# EAGLE design wire_detector (EAGLE 6.2)
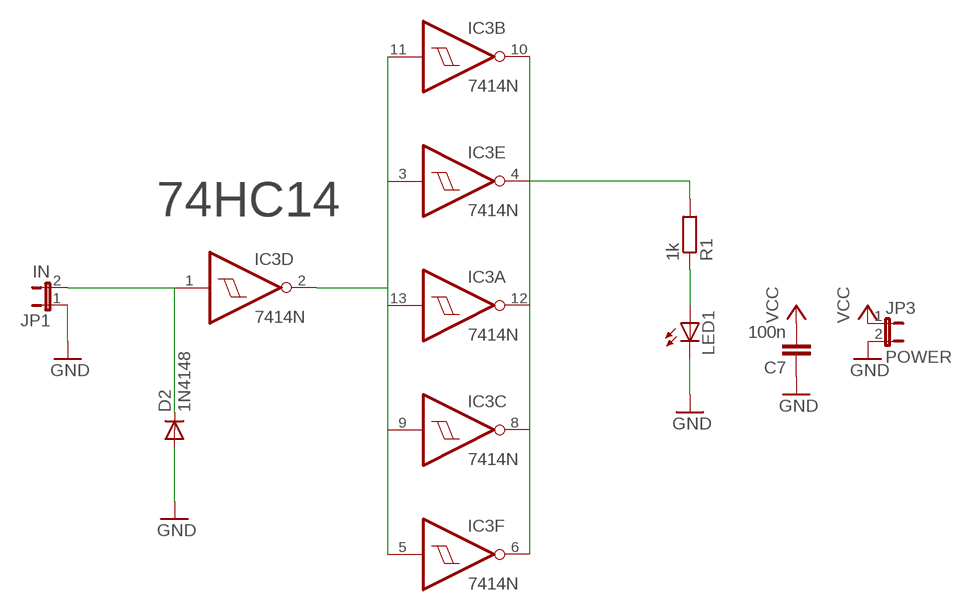
[diagram p0: schematic, sheet 1]

## Parts
C7  100n  C-EU025-024X044  [C025-024X044]
D2  1N4148  DIODE-D-2.5  [D-2.5]
IC3  7414N  [DIL14]
JP1  IN  JP1E  [JP1]
JP3  POWER  JP1E  [JP1]
LED1  LED5MM  [LED5MM]
R1  1k  R-EU_0204/5  [0204/5]

## Nets
GND: C7.1 D2.A JP1.1 JP3.2 LED1.K(C)
N$2: IC3.4(E:O) IC3.6(F:O) IC3.8(C:O) IC3.10(B:O) IC3.12(A:O) R1.2
N$3: LED1.A R1.1
N$5: IC3.2(D:O) IC3.3(E:I) IC3.5(F:I) IC3.9(C:I) IC3.11(B:I) IC3.13(A:I)
N$6: D2.C IC3.1(D:I) JP1.2
VCC: C7.2 JP3.1

## Notes on the sheet
- 74HC14

## Power pins joined to a net without a drawn wire
GND: IC3.7(P:GND)
VCC: IC3.14(P:VCC)

## Library data of the parts
C7 = rcl:C-EU: CAPACITOR, European symbol
D2 = diode:DIODE-: DIODE
IC3 = 74xx-eu:74*14: Hex schmitt trigger INVERTER
JP1 JP3 = jumper:JP1E: JUMPER
LED1 = led:LED: LED OSRAM: - CHIPLED LG R971, LG N971, LY N971, LG Q971, LY Q971, LO R971, LY R971 LH N974, LH R974 LS Q976, LO Q976, LY Q976 LO Q996 - Hyper CHIPLED LW Q18S LB Q993, LB Q99A, LB R99A - SideLED LS A670, LO A670, LY A670, LG A670, LP A670 LB A673, LV A673, LT A673, LW A673 LH A674 LY A675 LS A676, LA A676, LO A676, LY A676, LW A676 LS A679, LY A679, LG A679 - Hyper Micro SIDELED® LS Y876, LA Y876, LO Y876, LY Y876 LT Y87S - SmartLED LW L88C, LW L88S LB L89C, LB L89S, LG L890 LS L89K, LO L89K, LY L89K LS L896, LA L896, LO L896, LY L896 - TOPLED LS T670, LO T670, LY T670, LG T670, LP T670 LSG T670, LSP T670, LSY T670, LOP T670, LYG T670 LG T671, LOG T671, LSG T671 LB T673, LV T673, LT T673, LW T673 LH T674 LS T676, LA T676, LO T676, LY T676, LB T676, LH T676, LSB T676, LW T676 LB T67C, LV T67C, LT T67C, LS T67K, LO T67K, LY T67K, LW E67C LS E67B, LA E67B, LO E67B, LY E67B, LB E67C, LV E67C, LT E67C LW T67C LS T679, LY T679, LG T679 LS T770, LO T770, LY T770, LG T770, LP T770 LB T773, LV T773, LT T773, LW T773 LH T774 LS E675, LA E675, LY E675, LS T675 LS T776, LA T776, LO T776, LY T776, LB T776 LHGB T686 LT T68C, LB T68C - Hyper Mini TOPLED® LB M676 - Mini TOPLED Santana® LG M470 LS M47K, LO M47K, LY M47K Source: http://www.osram.convergy.de LUXEON: - LUMILED® LXK2-PW12-R00, LXK2-PW12-S00, LXK2-PW14-U00, LXK2-PW14-V00 LXK2-PM12-R00, LXK2-PM12-S00, LXK2-PM14-U00 LXK2-PE12-Q00, LXK2-PE12-R00, LXK2-PE12-S00, LXK2-PE14-T00, LXK2-PE14-U00 LXK2-PB12-K00, LXK2-PB12-L00, LXK2-PB12-M00, LXK2-PB14-N00, LXK2-PB14-P00, LXK2-PB14-Q00 LXK2-PR12-L00, LXK2-PR12-M00, LXK2-PR14-Q00, LXK2-PR14-R00 LXK2-PD12-Q00, LXK2-PD12-R00, LXK2-PD12-S00 LXK2-PH12-R00, LXK2-PH12-S00 LXK2-PL12-P00, LXK2-PL12-Q00, LXK2-PL12-R00 Source: www.luxeon.com KINGBRIGHT: KA-3528ASYC Source: www.kingbright.com
R1 = rcl:R-EU_: RESISTOR, European symbol

## Board
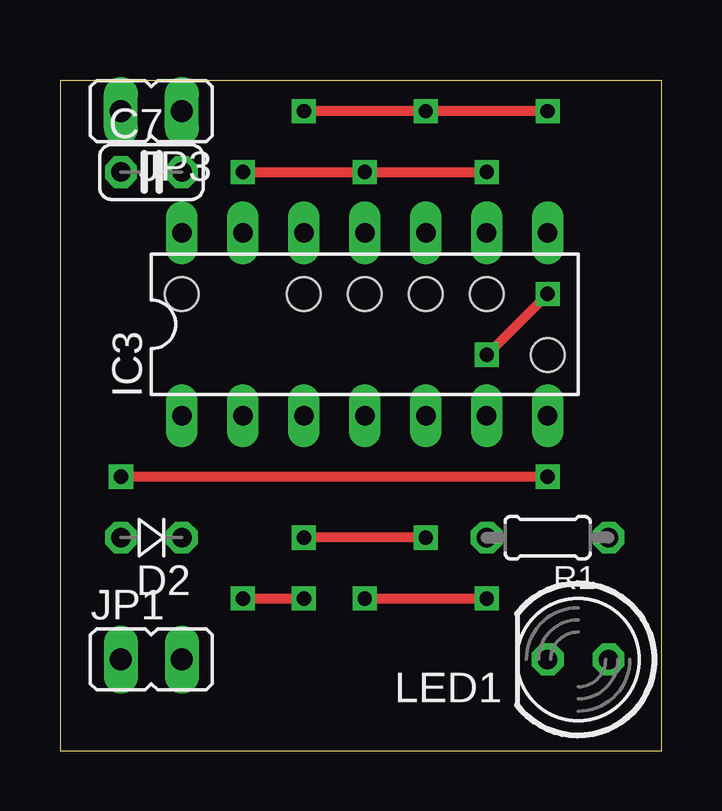
[diagram p1: board, top side]
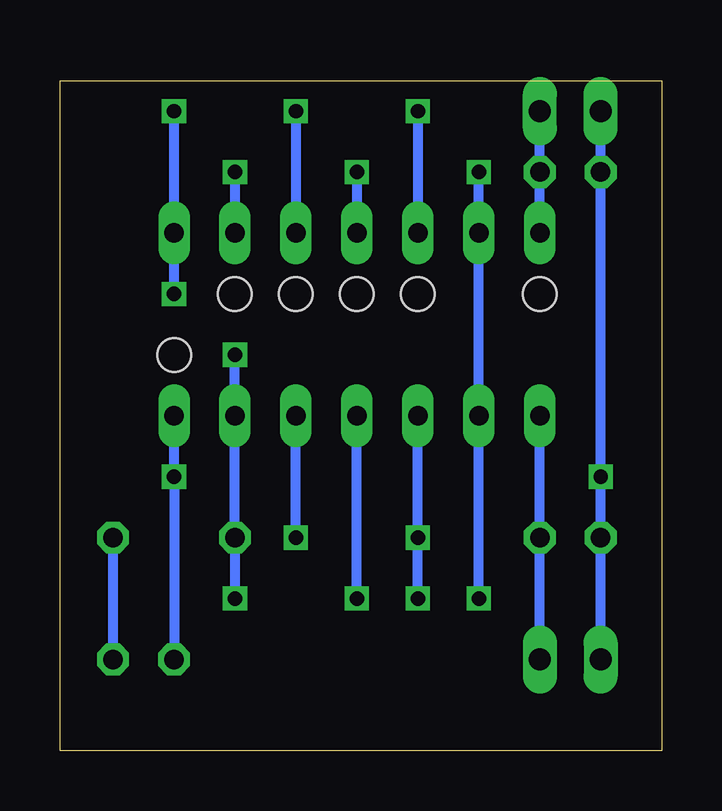
[diagram p2: board, bottom side, seen from below]

Size 25.07 x 27.93 mm. Coordinates in mm from the lower left corner, seen from the top.
Outline: 0,0 25.07,0 25.07,27.93 0,27.93 0,0
Copper layers (1*16): Top 0.035mm / dielectric 1.5mm / Bottom 0.035mm
Design rules: minimum track width 10mil, minimum drill 24mil, track to track 8mil, track to pad 8mil, pad to pad 8mil, via to via 8mil, smd to smd 8mil, copper to edge 40mil, drill to drill 8mil, minimum pad ring 10mil, minimum via ring 8mil, stop-mask expansion 4mil, vias tented up to drill 0mil, thermal gap 10mil
Holes 1.4 mm at 5.08,19.05 10.16,19.05 12.7,19.05 15.24,19.05 17.78,19.05 20.32,16.51

### Footprints (pad centres in the part's own frame; a part is rotated, then mirrored left to right if it is on the bottom)
C025-024X044 = drill 0.813 octagon: 1 -1.27,0; 2 1.27,0
D-2.5 = drill 0.813 octagon: A 1.27,0; C -1.27,0
DIL14 = drill 0.813 long: 1 -7.62,-3.81; 2 -5.08,-3.81; 3 -2.54,-3.81; 4 0,-3.81; 5 2.54,-3.81; 6 5.08,-3.81; 7 7.62,-3.81; 8 7.62,3.81; 9 5.08,3.81; 10 2.54,3.81; 11 0,3.81; 12 -2.54,3.81; 13 -5.08,3.81; 14 -7.62,3.81
JP1 = drill 0.914 long: 1 0,-1.27; 2 0,1.27
LED5MM = drill 0.813 octagon: A -1.27,0; K 1.27,0
0204/5 = drill 0.813 octagon: 1 -2.54,0; 2 2.54,0

### Placement (x,y rotation side)
C7  3.81,24.13 0 top
D2  3.81,8.89 180 top
IC3  12.7,17.78 0 top
JP1  3.81,3.81 270 top
JP3  3.81,26.67 90 top
LED1  21.59,3.81 180 top
R1  20.32,8.89 180 top

### Tracks (layer width: path | path; a pad name or v marks a point on that pad's centre or on a via)
GND  (via drill 0.6)
  Top 0.406: v2.54,11.43 v20.32,11.43
  Bottom 0.406: JP3.2 C7.1 v2.54,11.43 D2.A JP1.1 | LED1.K v20.32,11.43 IC3.7
N$2  (via drill 0.6)
  Top 0.406: v10.16,26.67 v15.24,26.67 v20.32,26.67 | v12.7,6.35 v17.78,6.35 | v17.78,16.51 v20.32,19.05
  Bottom 0.406: v10.16,26.67 IC3.12 | v15.24,26.67 IC3.10 | v20.32,26.67 IC3.8 v20.32,19.05 | v12.7,6.35 IC3.4 | v17.78,16.51 IC3.6 R1.2 v17.78,6.35
N$3
  Bottom 0.406: LED1.A R1.1
N$5  (via drill 0.6)
  Top 0.406: v7.62,24.13 v12.7,24.13 v17.78,24.13 | v7.62,6.35 v10.16,6.35 | v15.24,8.89 v10.16,8.89
  Bottom 0.406: v7.62,24.13 IC3.13 IC3.2 v7.62,6.35 | v12.7,24.13 IC3.11 | v17.78,24.13 IC3.9 | v10.16,6.35 v10.16,8.89 IC3.3 | v15.24,8.89 IC3.5
N$6
  Bottom 0.406: IC3.1 D2.C JP1.2
VCC
  Bottom 0.406: IC3.14 C7.2 JP3.1